# EAGLE schematic control_v26 (EAGLE 9.7.0)
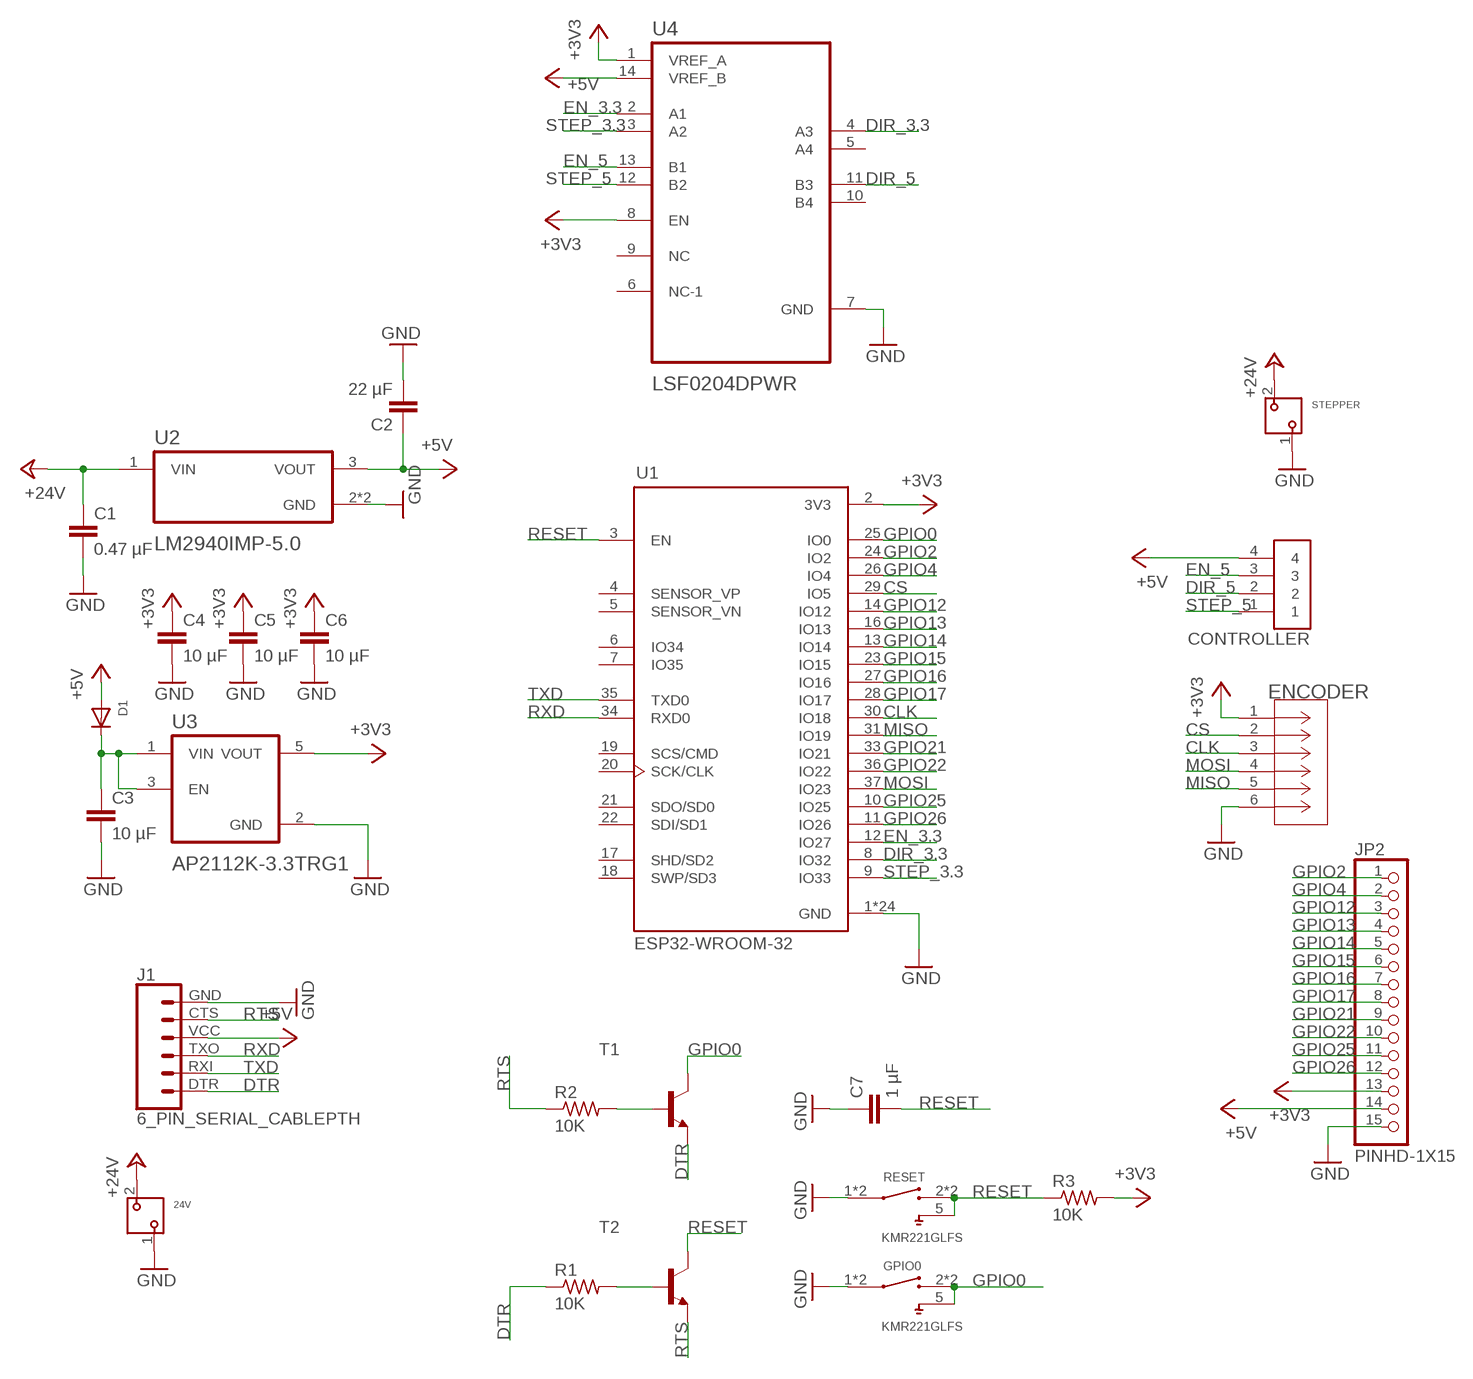
[diagram p0: schematic, sheet 1]

## Parts
24V  691412320002  [691412320002]
C1  0.47 µF  C-EUC0805  [C0805]
C2  22 µF  C-EUC0805  [C0805]
C3  10 µF  C-EUC0805  [C0805]
C4  10 µF  C-EUC0805  [C0805]
C5  10 µF  C-EUC0805  [C0805]
C6  10 µF  C-EUC0805  [C0805]
C7  1 µF  C-EUC0805  [C0805]
CONTROLLER  B4B-XH-A(LF)(SN)  [JST_B4B-XH-A(LF)(SN)]
D1  DIODESOD-123  [SOD-123]
ENCODER  B6B-XH-A_(LF)(SN)  [CONN_B6B-XH-A_JST]
GPIO0  KMR221GLFS  [SW_KMR221GLFS]
J1  6_PIN_SERIAL_CABLEPTH  [FTDI_BASIC]
JP2  PINHD-1X15  [1X15]
R1  10K  R-US_R0805  [R0805]
R2  10K  R-US_R0805  [R0805]
R3  10K  R-US_R0805  [R0805]
RESET  KMR221GLFS  [SW_KMR221GLFS]
STEPPER  691412320002  [691412320002]
T1  MMBT2222ALT1-NPN-SOT23-BEC  [SOT23-BEC]
T2  MMBT2222ALT1-NPN-SOT23-BEC  [SOT23-BEC]
U1  ESP32-WROOM-32  [MODULE_ESP32-WROOM-32]
U2  LM2940IMP-5.0  [SOT230P700X180-4N]
U3  AP2112K-3.3TRG1  [SOT95P285X140-5N]
U4  LSF0204DPWR  [SOP65P640X120-14N]

## Nets
+3V3: C4.1 C5.1 C6.1 ENCODER.1 JP2.13 R3.2 U1.2(3V3) U3.5(VOUT) U4.1(VREF_A) U4.8(EN)
+5V: C2.1 CONTROLLER.4 D1.A J1.VCC JP2.14 U2.3(VOUT) U4.14(VREF_B)
+24V: 24V.2 C1.1 STEPPER.2 U2.1(VIN)
CLK: ENCODER.3 U1.30(IO18)
CS: ENCODER.2 U1.29(IO5)
DIR_3.3: U1.8(IO32) U4.4(A3)
DIR_5: CONTROLLER.2 U4.11(B3)
DTR: J1.DTR R1.1 T1.E
EN_3.3: U1.12(IO27) U4.2(A1)
EN_5: CONTROLLER.3 U4.13(B1)
GND: 24V.1 C1.2 C2.2 C3.2 C4.2 C5.2 C6.2 C7.1 ENCODER.6 GPIO0.1 GPIO0.4 J1.GND JP2.15 RESET.1 RESET.4 STEPPER.1 U1.1(GND) U1.15(GND) U1.38(GND) U1.39_1(GND) U1.39_2(GND) U1.39_3(GND) U1.39_4(GND) U1.39_5(GND) U1.39_6(GND) U1.39_7(GND) U1.39_8(GND) U1.39_9(GND) U1.39_10(GND) U1.39_11(GND) U1.39_12(GND) U1.39_13(GND) U1.39_14(GND) U1.39_15(GND) U1.39_16(GND) U1.39_17(GND) U1.39_18(GND) U1.39_19(GND) U1.39_20(GND) U1.39_21(GND) U2.2(GND) U2.4(GND) U3.2(GND) U4.7(GND)
GPIO0: GPIO0.2 GPIO0.3 GPIO0.5 T1.C U1.25(IO0)
GPIO2: JP2.1 U1.24(IO2)
GPIO4: JP2.2 U1.26(IO4)
GPIO12: JP2.3 U1.14(IO12)
GPIO13: JP2.4 U1.16(IO13)
GPIO14: JP2.5 U1.13(IO14)
GPIO15: JP2.6 U1.23(IO15)
GPIO16: JP2.7 U1.27(IO16)
GPIO17: JP2.8 U1.28(IO17)
GPIO21: JP2.9 U1.33(IO21)
GPIO22: JP2.10 U1.36(IO22)
GPIO25: JP2.11 U1.10(IO25)
GPIO26: JP2.12 U1.11(IO26)
MISO: ENCODER.5 U1.31(IO19)
MOSI: ENCODER.4 U1.37(IO23)
N$1: C3.1 D1.C U3.1(VIN) U3.3(EN)
N$8: R1.2 T2.B
N$9: R2.2 T1.B
RESET: C7.2 R3.1 RESET.2 RESET.3 RESET.5 T2.C U1.3(EN)
RTS: J1.CTS R2.1 T2.E
RXD: J1.TXO U1.34(RXD0)
STEP_3.3: U1.9(IO33) U4.3(A2)
STEP_5: CONTROLLER.1 U4.12(B2)
TXD: J1.RXI U1.35(TXD0)
Unconnected: U1.4(SENSOR_VP) U1.5(SENSOR_VN) U1.6(IO34) U1.7(IO35) U1.17(SHD/SD2) U1.18(SWP/SD3) U1.19(SCS/CMD) U1.20(SCK/CLK) U1.21(SDO/SD0) U1.22(SDI/SD1) U4.5(A4) U4.6(NC-1) U4.9(NC) U4.10(B4)

## Library data of the parts
24V STEPPER = 691412320002:691412320002: WR-TBL Serie 4123 - 3.81 mm Screwless 45° Entry KIND PROPERTIES Pitch 3.81 mm MATERIAL PROPERTIES Insulator Material PA6/66 Insulator Flammability Rating UL94 V-0 Insulator Color Grey Contact Material Phosphor Bronze Contact Plating Matte Tin Wire Guard Material Phosphor Bronze GENERAL INFORMATION Operating Temperature -30 up to +120 °C Compliance Lead free / RoHS ELECTRICAL PROPERTIES IR UL 4 A IR VDE 4 A Working Voltage [UL] 300 V (AC) Working Voltage [VDE] 450 V (AC) Withstanding Voltage [UL] 1600 V (AC) Withstanding Voltage [VDE] 2500 V (AC) Contact Resistance 20 mΩ Mechanical Properties Wire Strip Length 7 (mm) Wire Properties Solid Wire Section (AWG) 16 to 30 (AWG) Solid Wire Section (Metric) 1.31 to 0.0509 (mm²) Stranded Wire Section (AWG) 16 to 30 (AWG) Stranded Wire Section (Metric) 1.31 to 0.0509 (mm²) CERTIFICATION UL Approval E150931 VDE Approval 40013441 Packaging Properties Packaging Box <https://www.we-online.com/catalog/media/o84303v209%20Family_WR-TBL4_6914123200xx.jpg> Details see: https://www.we-online.com/catalog/en/TBL_3_81_4123_SCREWLESS_45-DEGREE_ENTRY_6914123200xx/ Updated by Ella Wu 2019-12-31 2019(C) Wurth Elektronik; DESCRIPTION: 2 Position Wire to Board Terminal Block 45° (135°) Angle with Board 0.150 (3.81mm) Through Hole, Kinked Pin; DIGIKEY-PURCHASE-URL: https://snapeda.com/shop?store=DigiKey&id=2886139; MF: Wurth Electronics; MOUSER-PURCHASE-URL: https://snapeda.com/shop?store=Mouser&id=2886139; MP: 691412320002; PACKAGE: None
C1-C7 = rcl:C-EU: CAPACITOR, European symbol; SPICEPREFIX: C
CONTROLLER = B4B-XH-A_LF__SN_:B4B-XH-A(LF)(SN): XH Series 4 Position 2.5 mm Pitch Through Hole Crimp Top Entry Shrouded Header; DESCRIPTION: Connector Header Through Hole 4 position 0.098 (2.50mm); DIGI-KEY_PART_NUMBER: 455-2249-ND; DIGIKEY-PURCHASE-URL: https://snapeda.com/shop?store=DigiKey&id=447494; MF: JST Sales; MP: B4B-XH-A(LF)(SN); PACKAGE: None
D1 = adafruit:DIODE: Diode SMADIODE - SMA Surface Mount Package 20V 1A Schottky Diode Digikey: 641-1014-6-ND DO-1N4148 - Through Hole Small Current Diode SOD-123 20V 1 A (.5mV Vf) Schottky Diode - Digikey: MBRX120TPMSCT-ND SOD-323 10V 570mA (.38mV Vf, 3ns) Schottky Diode - Digikey: ZLLS410CT-ND SOD-523 30V 30mA Schottky Diode (RB751S-40TE61) - Digikey: RB751S-40TE61CT-ND SOT23-R/W - SOT23 Package (R = Solder Paste/Reflow Ovens, W = Hand-Soldering) BAT54Film 40V 300mA - Digikey: 497-7162-1-ND
ENCODER = B6B-XH-A_LF__SN_:B6B-XH-A_(LF)(SN); BUILT_BY: EMA_Cory; COPYRIGHT: Copyright (C) 2018 Accelerated Designs. All rights reserved; DATASHEET: http://www.jst-mfg.com/product/pdf/eng/eXH.pdf; MANUFACTURER_PART_NUMBER: B6B-XH-A (LF)(SN); SOURCELIBRARY: JST_2020-07-08; VENDOR: JST
GPIO0 RESET = KMR221GLFS:KMR221GLFS: Switch Tactile N.O. SPST Button Gull Wing 0.05A 32VDC 1VA 200000Cycles 2N SMD Automotive T/R; ARROW_ELECTRONICS-PURCHASE-URL: https://snapeda.com/shop?store=Arrow+Electronics&id=347724; DESCRIPTION: Tactile Switch SPST-NO Top Actuated Surface Mount; DIGI-KEY_PART_NUMBER: 401-1427-1-ND; DIGIKEY-PURCHASE-URL: https://snapeda.com/shop?store=DigiKey&id=347724; MF: C&K; MOUSER-PURCHASE-URL: https://snapeda.com/shop?store=Mouser&id=347724; MP: KMR221GLFS; PACKAGE: None
J1 = SparkFun-Connectors:6_PIN_SERIAL_CABLE: 6-pin header connection for use with the "FTDI BASIC" pinout - CABLE SIDE. Also known as "Arduino Serial Program Header". This is used on a design to provide a 6-pin connection point for serial communication usually from a USB cable (D+/D-) to these headers (RX/TX). It also has the remaining pins necessary for programming in the Arduino evironment (DTR, GND, and sometimes VCC). Note, this device has "CABLE" in the name. It is intended to be used on a design that usually lives on the end of your USB cable and prvides the converter chip (FTDI232 or FTDI231x) to commnicate serial RX/TX. The "sister" device, named "TARGET" is inteneded to be used on a design that contains a target micro-controller that you wish to program. You can populate with some of these: Female Headers <https://www.sparkfun.com/products/115> (PRT-00115) For reference (or to suit your programming needs) check out these designs: SparkFun FTDI Basic Breakout - 5V <https://www.sparkfun.com/products/9716> (DEV-09716) SparkFun FTDI Basic Breakout - 3.3V <https://www.sparkfun.com/products/9873> (DEV-09873) SparkFun FTDI SmartBasic <https://www.sparkfun.com/products/12935> (DEV-12935) SparkFun Beefy 3 - FTDI Basic Breakout <https://www.sparkfun.com/products/13746> (DEV-13746)
JP2 = Connector:PINHD-1X15: PIN HEADER; CATEGORY: CONNECTOR; SUB-CATEGORY: PIN-HEADER
R1-R3 = rcl:R-US_: RESISTOR, American symbol; SPICEPREFIX: R
T1 T2 = transistor:*-NPN-: NPN Transistror BF959 corrected 2008.03.06
U1 = ESP32-WROOM-32:ESP32-WROOM-32: Bluetooth, WiFi Transceiver Module 2.4GHz ~ 2.5GHz Surface Mount; DESCRIPTION: Bluetooth, WiFi Transceiver Module 2.4GHz ~ 2.5GHz Surface Mount; DIGI-KEY_PART_NUMBER: 1904-1010-1-ND; MF: Espressif Systems; MP: ESP32-WROOM-32; PACKAGE: Module Espressif Systems
U2 = LM2940IMP-5.0:LM2940IMP-5.0; DESCRIPTION: 1-A, 26-V, high-PSRR, low-dropout voltage regulator 4-SOT-223 -40 to 85; DIGI-KEY_PART_NUMBER: LM2940IMP-5.0/NOPBCT-ND; DIGIKEY-PURCHASE-URL: https://snapeda.com/shop?store=DigiKey&id=18138; MF: Texas Instruments; MOUSER-PURCHASE-URL: https://snapeda.com/shop?store=Mouser&id=18138; MP: LM2940IMP-5.0/NOPB; PACKAGE: SOT-223-4 Texas Instruments; TEXAS_INSTRUMENTS-PURCHASE-URL: https://snapeda.com/shop?store=Texas+Instruments&id=18138
U3 = AP2112K-3.3TRG1:AP2112K-3.3TRG1: AP2112 Series 0.6 A 3.3 V Fixed Output SMT LDO Linear Regulator - SOT23-5; DESCRIPTION: Linear Voltage Regulator IC 1 Output 600mA SOT-25; DIGI-KEY_PART_NUMBER: AP2112K-3.3TRG1DICT-ND; DIGIKEY-PURCHASE-URL: https://snapeda.com/shop?store=DigiKey&id=454988; MF: Diodes Inc.; MOUSER-PURCHASE-URL: https://snapeda.com/shop?store=Mouser&id=454988; MP: AP2112K-3.3TRG1; PACKAGE: SOT-753 Diodes Inc.
U4 = LSF0204DPWR:LSF0204DPWR: None; DESCRIPTION: 4-Bit Bidirectional Multi-Voltage Level Translator for Open-Drain & Push-Pull 14-TSSOP -40 to 125; DIGI-KEY_PART_NUMBER: 296-40400-1-ND; MF: Texas Instruments; MOUSER-PURCHASE-URL: https://snapeda.com/shop?store=Mouser&id=377950; MP: LSF0204DPWR; PACKAGE: TSSOP-14 Texas Instruments; TEXAS_INSTRUMENTS-PURCHASE-URL: https://snapeda.com/shop?store=Texas+Instruments&id=377950